# EasyEDA schematic Arduino pro micro sch.json
TITLE: Sheet_1; REV: 1.0; Date: 2024-05-25; Sheet: 1/1; Drawn By: kritartha
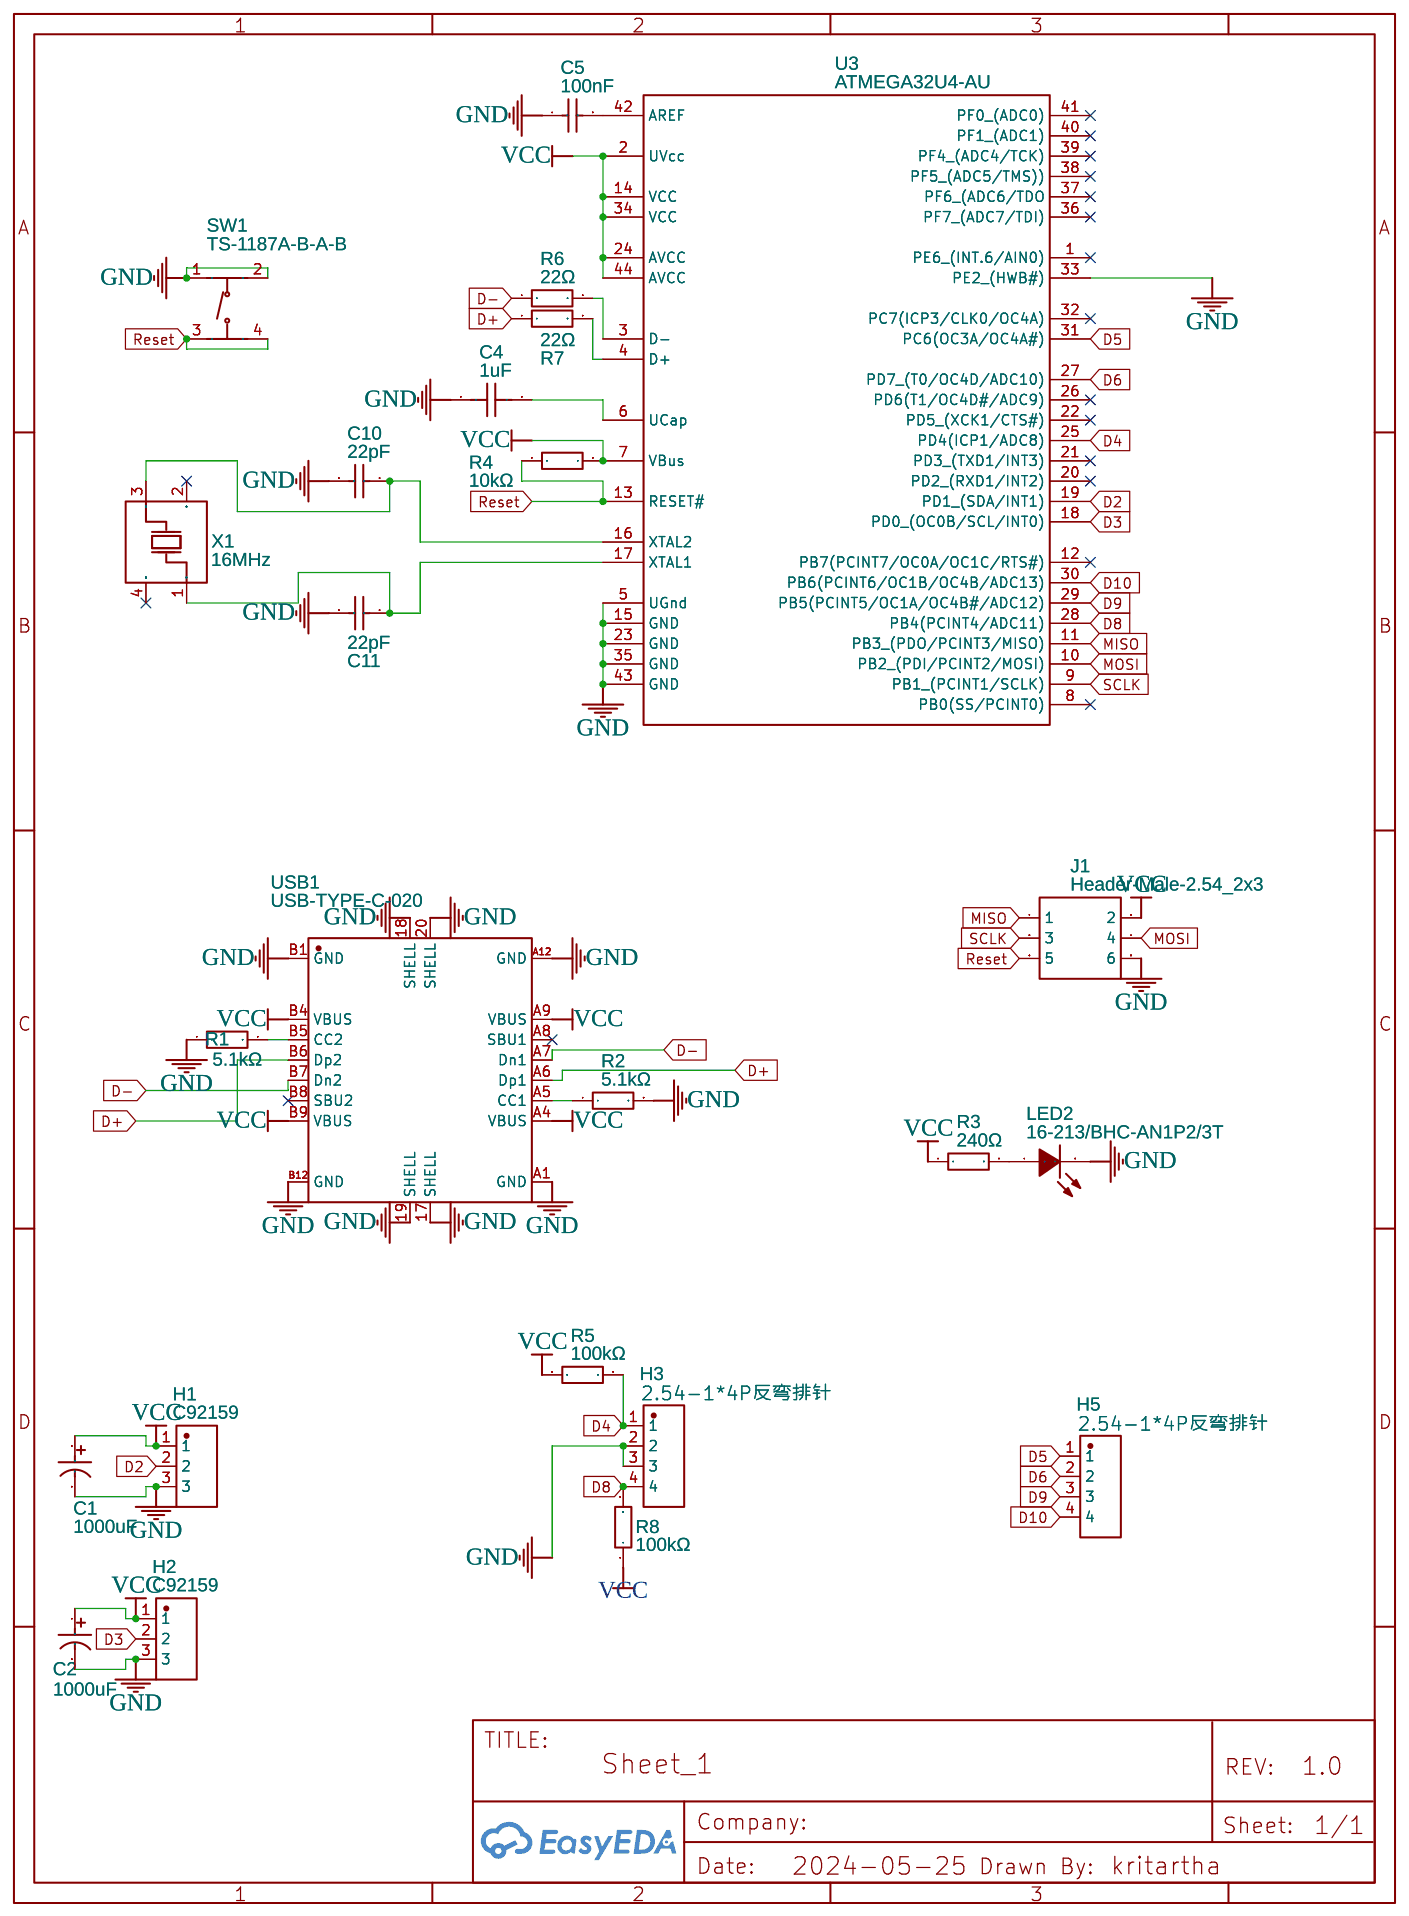
[diagram p0: schematic sheet]

## Parts
C1  1000uF  [CAP-SMD_BD10.0-L10.3-W10.3-FD]
C2  1000uF  [CAP-SMD_BD10.0-L10.3-W10.3-FD]
C4  1uF  [C0402]
C5  100nF  [C0402]
C10  22pF  [C0402]
C11  22pF  [C0402]
H1  C92159  [HDR-TH_3P-P2.54-H-M-BW7.2-P]
H2  C92159  [HDR-TH_3P-P2.54-H-M-BW7.2-P]
H3  2.54-1*4P反弯排针  [HDR-TH_4P-P2.54-H-M-W10.4]
H5  2.54-1*4P反弯排针  [HDR-TH_4P-P2.54-H-M-W10.4]
J1  Header-Male-2.54_2x3  [HDR-TH_6P-P2.54-V-M-R2-C3-S2.54-1]
LED2  16-213/BHC-AN1P2/3T  [LED0402-R-RD]
R1  5.1kΩ  [R0402]
R2  5.1kΩ  [R0402]
R3  240Ω  [R0603]
R4  10kΩ  [R0402]
R5  100kΩ  [R0402]
R6  22Ω  [R0402]
R7  22Ω  [R0402]
R8  100kΩ  [R0402]
SW1  TS-1187A-B-A-B  [SW-SMD_4P-L5.1-W5.1-P3.70-LS6.5-TL-2]
U3  ATMEGA32U4-AU  [QFP-44_L10.0-W10.0-P0.80-LS13.2-BL]
USB1  USB-TYPE-C-020  [USB-SMD_USB-TYPE-C-020]
X1  16MHz  [OSC-SMD_4P-L3.2-W2.5-BL]

## Library data of the parts
C1 C2 = RVT1C102M1010_C3359: Supplier: LCSC; Manufacturer: HONOR(荣誉); Manufacturer Part: RVT1C102M1010; Supplier Part: C3359; JLCPCB Part Class: Extended Part
C4 = CL05A105KA5NQNC: Supplier: LCSC; Manufacturer: SAMSUNG(三星); Supplier Part: C52923; JLCPCB Part Class: Basic Part
C5 = CL05B104KO5NNNC: Supplier: LCSC; Manufacturer: SAMSUNG(三星); Supplier Part: C1525; JLCPCB Part Class: Basic Part
C10 C11 = 0402CG220J500NT: Supplier: LCSC; Manufacturer: FH(风华); Supplier Part: C1555; JLCPCB Part Class: Basic Part
H1 H2 = C92159: Contributor: LCSC; Supplier: LCSC; Manufacturer: BOOMELE(博穆精密); Manufacturer Part: 2.54-1*3P正弯针; JLCPCB Part Class: Extended Part
H3 H5 = 2.54-1*4P反弯排针: Contributor: LCSC; Supplier: LCSC; Supplier Part: C91552; Manufacturer: BOOMELE(博穆精密); JLCPCB Part Class: Extended Part
J1 = Header-Male-2.54_2x3: Supplier: LCSC; Manufacturer: BOOMELE(博穆精密); Manufacturer Part: 2.54-2*3P针; Supplier Part: C65114; JLCPCB Part Class: Extended Part
LED2 = 16-213/BHC-AN1P2/3T: Contributor: LCSC; Supplier: LCSC; Manufacturer: EVERLIGHT(亿光); Supplier Part: C131223; JLCPCB Part Class: Extended Part
R1 R2 = 0402WGF5101TCE: Supplier: LCSC; Manufacturer: UNI-ROYAL(厚声); Supplier Part: C25905; JLCPCB Part Class: Basic Part
R3 = RS-03K2400FT: Contributor: LCSC; Supplier: LCSC; Supplier Part: C286579; Manufacturer: FH(风华); JLCPCB Part Class: Extended Part
R4 = 0402WGF1002TCE: Supplier: LCSC; Manufacturer: UNI-ROYAL(厚声); Supplier Part: C25744; JLCPCB Part Class: Basic Part
R5 R8 = 0402WGF1003TCE: Supplier: LCSC; Manufacturer: UNI-ROYAL(厚声); Supplier Part: C25741; JLCPCB Part Class: Basic Part
R6 R7 = 0402WGF220JTCE: Supplier: LCSC; Manufacturer: UNI-ROYAL(厚声); Supplier Part: C25092; JLCPCB Part Class: Basic Part
SW1 = TS-1187A-B-A-B: Contributor: LCSC; Supplier: LCSC; Supplier Part: C318884; Manufacturer: XKB Connectivity(中国星坤); JLCPCB Part Class: Basic Part
U3 = ATMEGA32U4-AU: Supplier: LCSC; Manufacturer: MICROCHIP(美国微芯); Supplier Part: C44854; JLCPCB Part Class: Extended Part
USB1 = USB-TYPE-C-020: Supplier: LCSC; Supplier Part: C2927040; Manufacturer: DEALON(德艺隆); Contributor: lcsc
X1 = X322516MLB4SI: Supplier: LCSC; Manufacturer: YXC(扬兴晶振); Supplier Part: C13738; JLCPCB Part Class: Basic Part

## Nets
GND: C1.2 C2.2 C4.1 C5.1 C10.1 C11.1 H1.3 H2.3 H3.2 H3.3 J1.6 LED2.2(K) R1.1 R2.2 SW1.1(A) SW1.2(B) U3.5(UGnd) U3.15(GND) U3.23(GND) U3.33(PE2 (HWB#)) U3.35(GND) U3.43(GND) USB1.17(SHELL) USB1.18(SHELL) USB1.19(SHELL) USB1.20(SHELL) USB1.A1(GND) USB1.A12(GND) USB1.B1(GND) USB1.B12(GND)
VCC: C1.1 C2.1 H1.1 H2.1 J1.2 R3.1 R4.2 R5.2 R8.1 U3.2(UVcc) U3.7(VBus) U3.14(VCC) U3.24(AVCC) U3.34(VCC) U3.44(AVCC) USB1.A4(VBUS) USB1.A9(VBUS) USB1.B4(VBUS) USB1.B9(VBUS)
D2: H1.2 U3.19(PD1 (SDA/INT1))
D3: H2.2 U3.18(PD0 (OC0B/SCL/INT0))
D4: H3.1 R5.1 U3.25(PD4(ICP1/ADC8))
D5: H5.1 U3.31(PC6(OC3A/OC4A#))
D6: H5.2 U3.27(PD7 (T0/OC4D/ADC10))
D8: H3.4 R8.2 U3.28(PB4(PCINT4/ADC11))
D9: H5.3 U3.29(PB5(PCINT5/OC1A/OC4B#/ADC12))
D10: H5.4 U3.30(PB6(PCINT6/OC1B/OC4B/ADC13))
D+: R7.1 USB1.A6(Dp1) USB1.B6(Dp2)
D-: R6.1 USB1.A7(Dn1) USB1.B7(Dn2)
MISO: J1.1 U3.11(PB3 (PDO/PCINT3/MISO))
MOSI: J1.4 U3.10(PB2 (PDI/PCINT2/MOSI))
Reset: J1.5 R4.1 SW1.3(C) SW1.4(D) U3.13(RESET#)
SCLK: J1.3 U3.9(PB1 (PCINT1/SCLK))
Net-(C4-2): C4.2 U3.6(UCap)
Net-(C5-2): C5.2 U3.42(AREF)
Net-(C10-2): C10.2 U3.16(XTAL2) X1.3(OSC2)
Net-(C11-2): C11.2 U3.17(XTAL1) X1.1(OSC1)
Net-(LED2-1): LED2.1(A) R3.2
Net-(R1-2): R1.2 USB1.B5(CC2)
Net-(R2-1): R2.1 USB1.A5(CC1)
Net-(R6-2): R6.2 U3.3(D-)
Net-(R7-2): R7.2 U3.4(D+)

Not connected (* = marked no-connect by the designer): U3 1(PE6 (INT.6/AIN0))* 8(PB0(SS/PCINT0))* 12(PB7(PCINT7/OC0A/OC1C/RTS#))* 20(PD2 (RXD1/INT2))* 21(PD3 (TXD1/INT3))* 22(PD5 (XCK1/CTS#))* 26(PD6(T1/OC4D#/ADC9))* 32(PC7(ICP3/CLK0/OC4A))* 36(PF7 (ADC7/TDI))* 37(PF6 (ADC6/TDO)* 38(PF5 (ADC5/TMS)))* 39(PF4 (ADC4/TCK))* 40(PF1 (ADC1))* 41(PF0 (ADC0))*; USB1 A8(SBU1)* B8(SBU2)*; X1 2(GND)* 4(GND)*
